# EAGLE design shinobi_BLE (EAGLE 8.5.1)
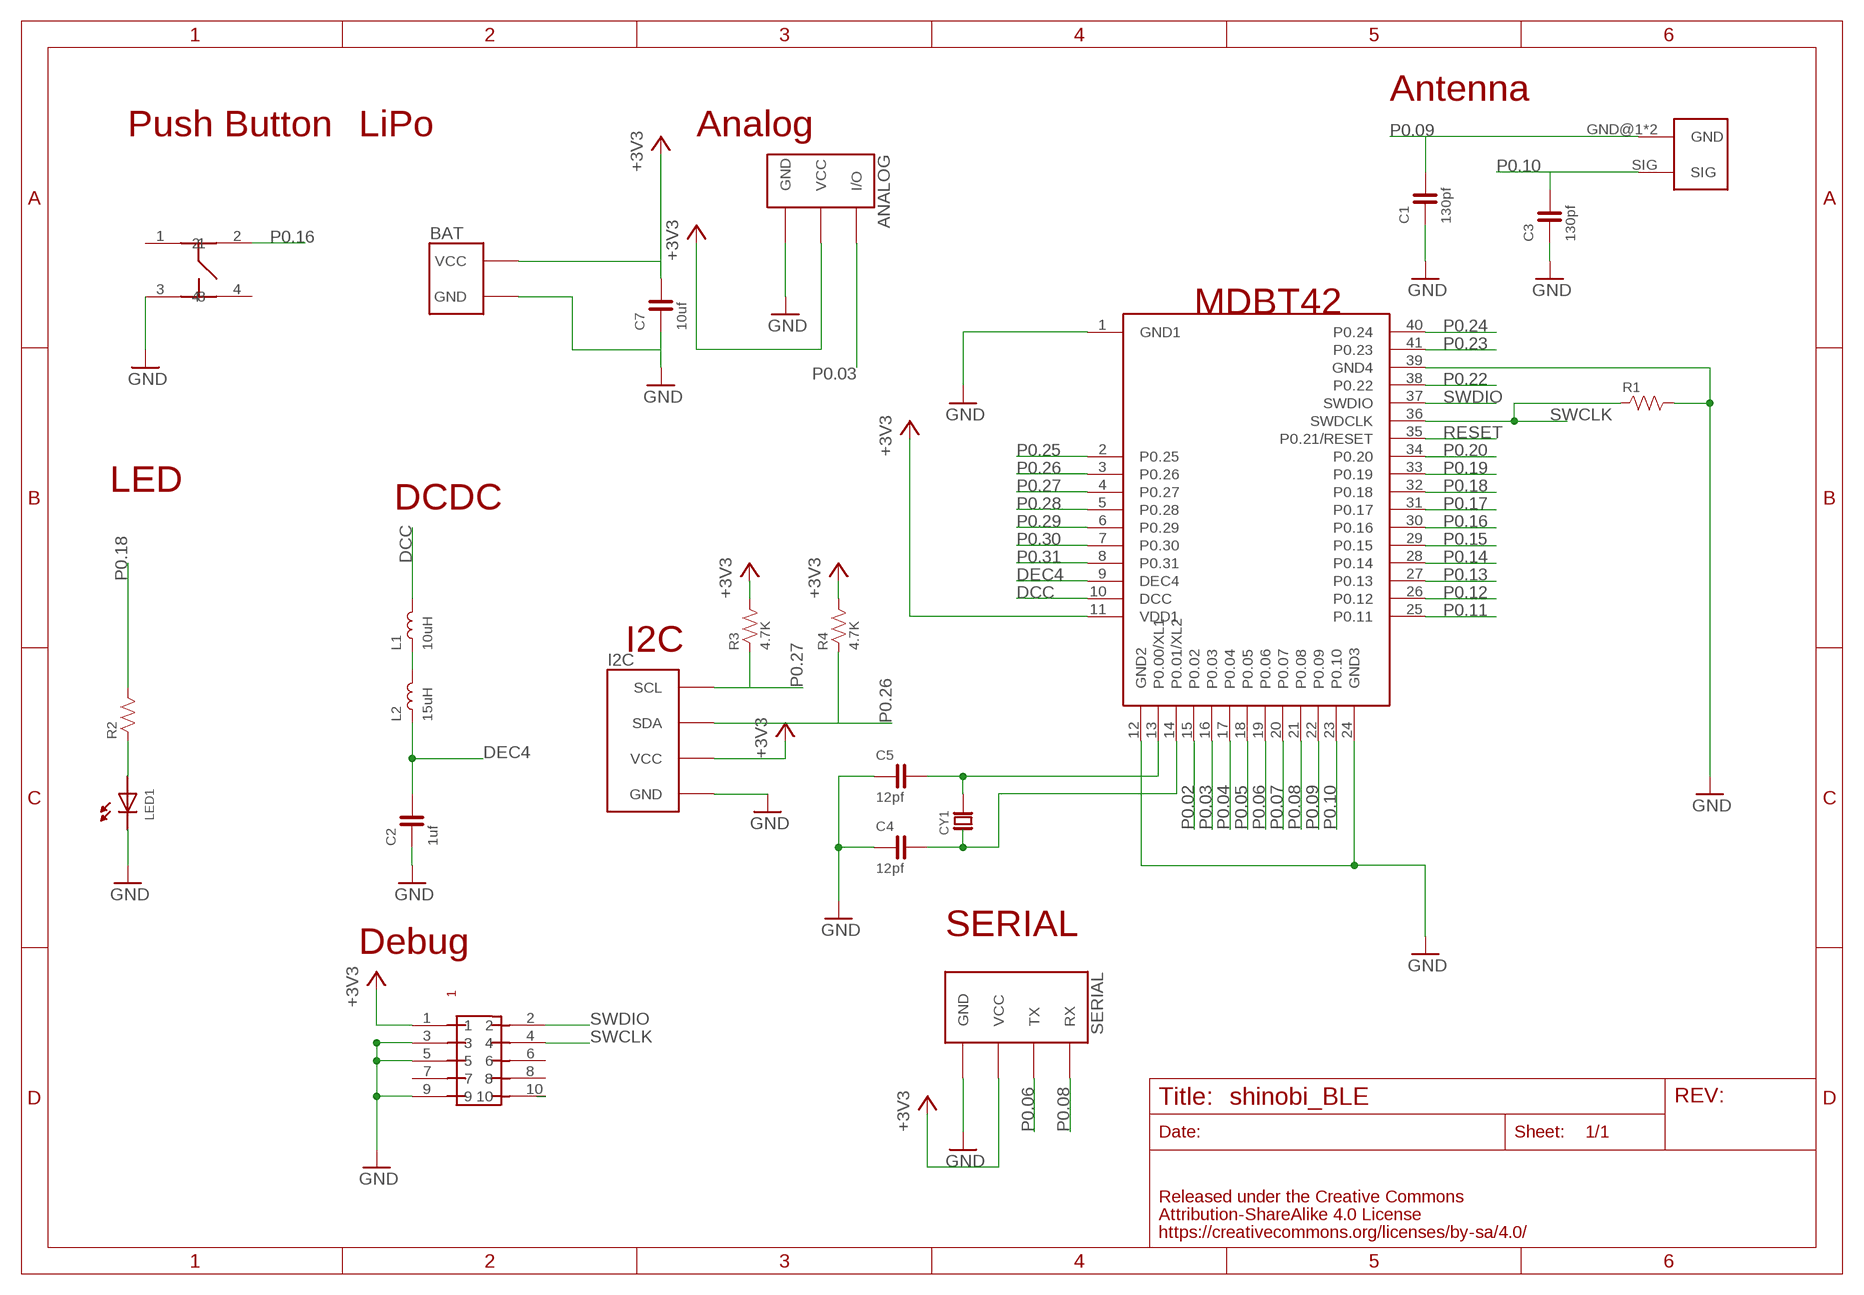
[diagram p0: schematic, sheet 1]

## Parts
ANALOG  FABO_BRICK_3PIN-S03B-PASK-2_LONG  [FABO_BRICK_3PIN_S03B-PASK-2_LONG]
BAT  FABO_BRICK_2PIN_SIDE  [FABO_BRICK_2PIN_S02B−PASK-2_SILK]
C1  130pf  CAPACITOR-0603  [0603]
C2  1uf  CAPACITOR-0603  [0603]
C3  130pf  CAPACITOR-0603  [0603]
C4  12pf  CAPACITOR-0603  [0603]
C5  12pf  CAPACITOR-0603  [0603]
C7  10uf  CAPACITOR-0603  [0603]
CY1  CRYSTAL-ABS07  [ABRACON-ABS07-32.768KHZ]
I2C  FABO_BRICK_I2C-S04B-PASK-2_LONG  [FABO_BRICK_I2C_S04B-PASK-2_LONG]
L1  10uH  INDUCTOR-0603  [0603]
L2  15uH  INDUCTOR-1812  [1812]
LED1  LED-0603  [0603]
R1  RESISTOR-0603  [0603]
R2  RESISTOR-0603  [0603]
R3  4.7K  RESISTOR-0603  [0603]
R4  4.7K  RESISTOR-0603  [0603]
SERIAL  FABO_BRICK_SERIAL-S04B-PASK-2_LONG  [FABO_BRICK_SERIAL_S04B-PASK-2_LONG]
U$2  RAYTAC-MDBT42  [RAYTAC-MDBT42]
U$4  PIN-HEADER-SMT(1.27MM)2X5  [PIN-HEADER-SMT(1.27MM)2X5]
U$5  SWICTH-4P(KMR2)  [SWITCH-4P(KMR2)]
UF1  HIROSE-U.FL  [HIROSE-UF.L]

## Nets
+3V3: ANALOG.VCC BAT.VCC C7.2 I2C.VCC R3.2 R4.2 SERIAL.VCC U$2.11(VDD1) U$4.1
DCC: L1.2 U$2.10(DCC)
DEC4: C2.2 L2.P$1 U$2.9(DEC4)
GND: ANALOG.GND BAT.GND C1.1 C2.1 C3.1 C4.1 C5.1 C7.1 I2C.GND LED1.CATHODE R1.2 SERIAL.GND U$2.1(GND1) U$2.12(GND2) U$2.24(GND3) U$2.39(GND4) U$4.3 U$4.5 U$4.9 U$5.3
N$1: LED1.ANODE R2.1
N$2: L1.1 L2.P$2
N$7: C5.2 CY1.P$2 U$2.13(P0.00/XL1)
N$8: C4.2 CY1.P$1 U$2.14(P0.01/XL2)
P0.02: U$2.15(P0.02)
P0.03: ANALOG.I/O U$2.16(P0.03)
P0.04: U$2.17(P0.04)
P0.05: U$2.18(P0.05)
P0.06: SERIAL.TX U$2.19(P0.06)
P0.07: U$2.20(P0.07)
P0.08: SERIAL.RX U$2.21(P0.08)
P0.09: C1.2 U$2.22(P0.09) UF1.GND@1(GND) UF1.GND@2(GND)
P0.10: C3.2 U$2.23(P0.10) UF1.SIG
P0.11: U$2.25(P0.11)
P0.12: U$2.26(P0.12)
P0.13: U$2.27(P0.13)
P0.14: U$2.28(P0.14)
P0.15: U$2.29(P0.15)
P0.16: U$2.30(P0.16) U$5.2
P0.17: U$2.31(P0.17)
P0.18: R2.2 U$2.32(P0.18)
P0.19: U$2.33(P0.19)
P0.20: U$2.34(P0.20)
P0.22: U$2.38(P0.22)
P0.23: U$2.41(P0.23)
P0.24: U$2.40(P0.24)
P0.25: U$2.2(P0.25)
P0.26: I2C.SDA R4.1 U$2.3(P0.26)
P0.27: I2C.SCL R3.1 U$2.4(P0.27)
P0.28: U$2.5(P0.28)
P0.29: U$2.6(P0.29)
P0.30: U$2.7(P0.30)
P0.31: U$2.8(P0.31)
RESET: U$2.35(P0.21/RESET)
RESET1: U$4.10
SWCLK: R1.1 U$2.36(SWDCLK) U$4.4
SWDIO: U$2.37(SWDIO) U$4.2
Unconnected: U$4.6 U$4.7 U$4.8 U$5.1 U$5.4

## Notes on the sheet
- Antenna
- Push Button | LiPo | Analog
- MDBT42
- LED
- DCDC
- I2C
- SERIAL
- Debug

## Library data of the parts
ANALOG = FaBo-Template:FABO_BRICK_3PIN: FaBo Brick 3pin
BAT = FaBo-Template:FABO_BRICK_2PIN
C1-C5 C7 = FaBo-Capacitor:CAPACITOR: CAPACITOR
CY1 = FaBo-Crystal:CRYSTAL
I2C = FaBo-Template:FABO_BRICK_I2C: FaBo Brick I2C
L1 L2 = FaBo-Inductor:INDUCTOR: RESISTOR
LED1 = FaBo-LED:LED
R1-R4 = FaBo-Resistors:RESISTOR: RESISTOR
SERIAL = FaBo-Template:FABO_BRICK_SERIAL: FaBo Brick Serial
U$2 = FaBo-BT:RAYTAC-MDBT42
U$4 = gclue:PIN-HEADER-SMT(1.27MM)2X5: PIN-HEADER-SMT (1.27MM) 2x5
U$5 = gclue-test:SWICTH-4P(KMR2)
UF1 = FaBo-Connetor:HIROSE-U.FL

## Board
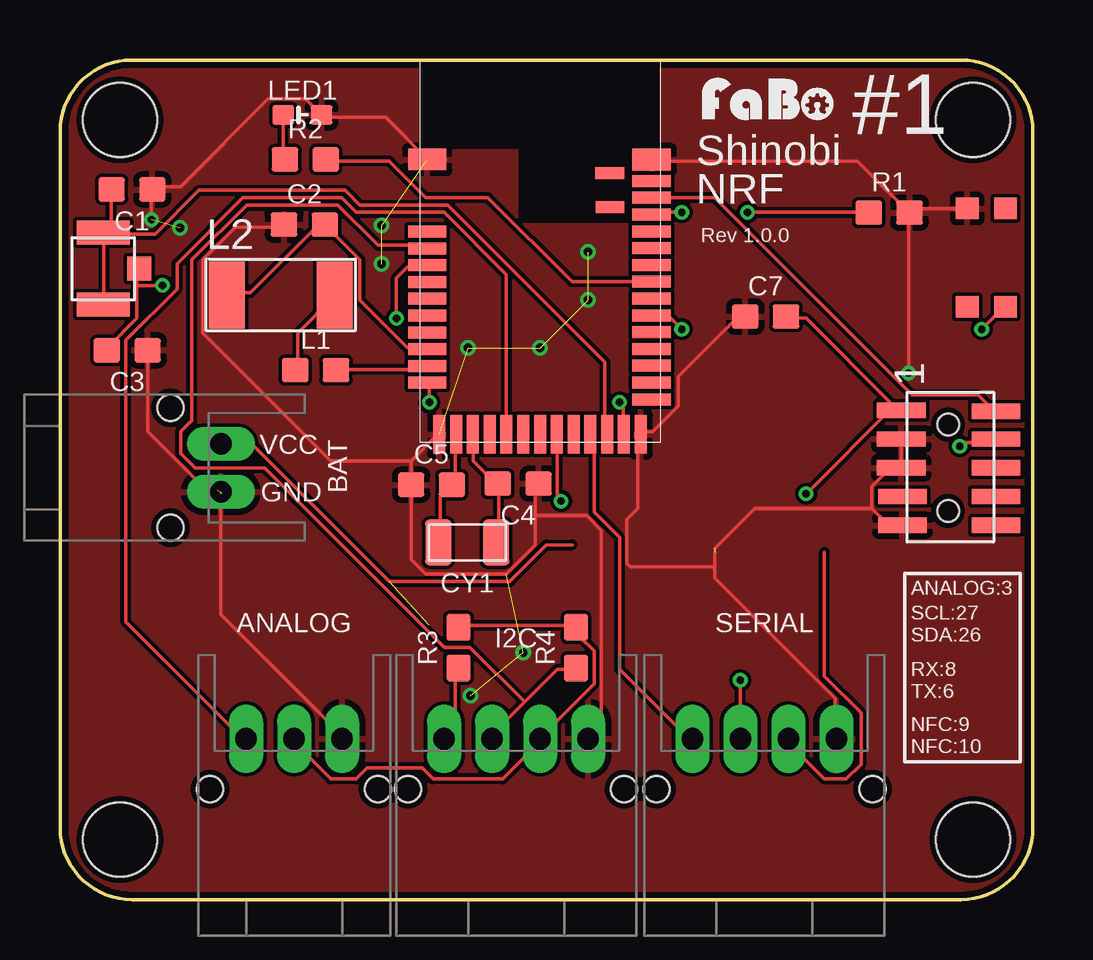
[diagram p1: board, top side]
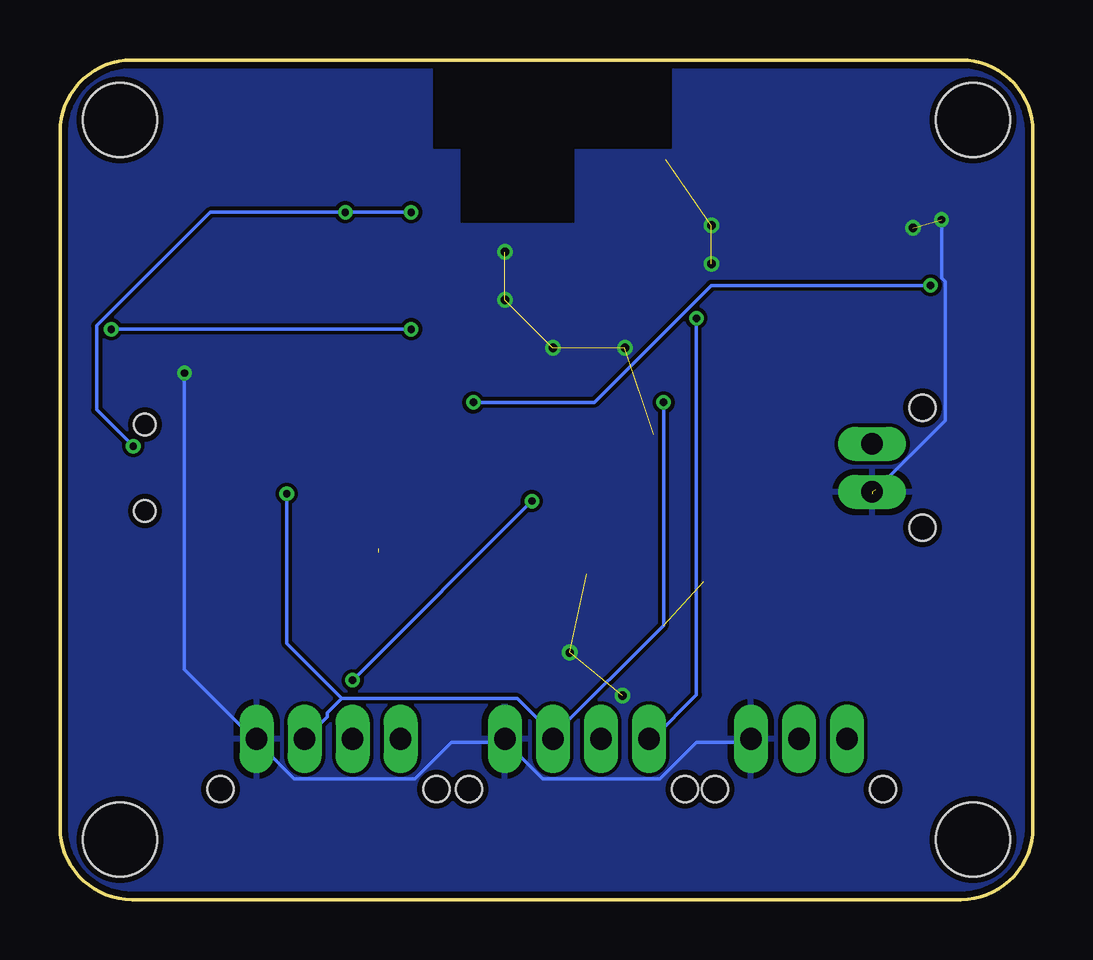
[diagram p2: board, bottom side, seen from below]

Size 40.54 x 35 mm. Coordinates in mm from the lower left corner, seen from the top.
Copper layers (1*16): Top 0.035mm / dielectric 1.5mm / Bottom 0.035mm
Design rules "SeeedStudio_2layer_DRU_no_angle_20140221": minimum track width 6mil, minimum drill 12mil, track to track 6mil, track to pad 6mil, pad to pad 6mil, via to via 6mil, smd to smd 0mil, copper to edge 10mil, drill to drill 10mil, minimum pad ring 10mil, minimum via ring 6mil, stop-mask expansion 2mil, vias tented up to drill 100mil, thermal gap 10mil

### Footprints (pad centres in the part's own frame; a part is rotated, then mirrored left to right if it is on the bottom)
FABO_BRICK_3PIN_S03B-PASK-2_LONG = drill 0.9 pad 1.422 long: GND -2,0; I/O 2,0; VCC 0,0 | hole 1.1: 3.5,2.1; -3.5,2.1
FABO_BRICK_2PIN_S02B−PASK-2_SILK = drill 0.9 pad 1.422 long: GND -1,-0.102; VCC 1,-0.102 | hole 1.1: 2.5,1.998; -2.5,1.998
0603 = smd 1.1 x 1: 1 -0.85,0; 2 0.85,0
ABRACON-ABS07-32.768KHZ = smd 1.1 x 1.9: P$1 -1.2,0; P$2 1.2,0
FABO_BRICK_I2C_S04B-PASK-2_LONG = drill 0.9 pad 1.422 long: GND -3,0; SCL 3,0; SDA 1,0; VCC -1,0 | hole 1.1: 4.5,2.1; -4.5,2.1
1812 = smd 1.5 x 2.8: P$1 -2.25,0; P$2 2.25,0
0603' = smd 0.9 x 0.8: ANODE -0.8,0; CATHODE 0.8,0
FABO_BRICK_SERIAL_S04B-PASK-2_LONG = drill 0.9 pad 1.422 long: GND -3,0; RX 3,0; TX 1,0; VCC -1,0 | hole 1.1: 4.5,2.1; -4.5,2.1
FABO-SHINOBI = hole 3.1: 2.5,32.5; 38.04,32.5; 38.04,2.5; 2.5,2.5
RAYTAC-MDBT42 = smd 1.6 x 0.9: 1 -4.7,3.8; 39 4.65,3.79 | smd 1.6 x 0.5: 2 -4.7,0.79; 3 -4.7,0.09; 4 -4.7,-0.61; 5 -4.7,-1.31; 6 -4.7,-2.01; 7 -4.7,-2.71; 8 -4.7,-3.41; 9 -4.7,-4.11; 10 -4.7,-4.81; 11 -4.7,-5.51; 25 4.65,-6.2; 26 4.65,-5.5; 27 4.65,-4.8; 28 4.65,-4.1; 29 4.65,-3.4; 30 4.65,-2.7; 31 4.65,-2; 32 4.65,-1.3; 33 4.65,-0.6; 34 4.65,0.1; 35 4.65,0.8; 36 4.65,1.5; 37 4.65,2.2; 38 4.65,2.9 | smd 0.5 x 1.6: 12 -4.2,-7.66; 13 -3.5,-7.66; 14 -2.8,-7.66; 15 -2.1,-7.66; 16 -1.4,-7.66; 17 -0.7,-7.66; 18 0,-7.66; 19 0.7,-7.66; 20 1.4,-7.66; 21 2.1,-7.66; 22 2.8,-7.66; 23 3.48,-7.66; 24 4.2,-7.66 | smd 1.2 x 0.5: 40 2.91,3.23; 41 2.92,1.81
PIN-HEADER-SMT(1.27MM)2X5 = smd 0.635 x 2.032: 1 -2.4,-1.95; 2 -2.35,2; 3 -1.2,-1.95; 4 -1.2,2; 5 0,-1.95; 6 0,2; 7 1.2,-1.9; 8 1.2,2; 9 2.4,-1.9; 10 2.4,2 | hole 0.9: 1.8,0; -1.8,0
SWITCH-4P(KMR2) = smd 0.9 x 0.95: 1 -1,0; 2 3.1,0; 3 -1,-1.6; 4 3.1,-1.6
HIROSE-UF.L = smd 1 x 2.2: GND@1 -1.5,0; GND@2 1.5,0 | smd 1 x 1: SIG 0,-1.5

### Placement (x,y rotation side)
ANALOG  9.75,6.7 180 top
BAT  6.6,18 90 top
C1  3,29.6 180 top
C2  10.18,28.14 0 top
C3  2.8,22.9 180 top
C4  19.09,17.34 180 top
C5  15.48,17.29 0 top
C7  29.4,24.3 0 top
CY1  16.97,14.89 180 top
I2C  19,6.7 180 top
L1  10.65,22.07 0 top
L2  9.2,25.2 0 top
LED1  [0603']  10.1,32.71 0 top
R1  34.55,28.63 0 top
R2  10.22,30.85 0 top
R3  16.6,10.5 90 top
R4  21.5,10.5 90 top
SERIAL  29.35,6.7 180 top
U$1  [FABO-SHINOBI]  0,0 0 top
U$2  20,27.05 0 top
U$3  [LOGO_FABO_S]  29.55,32.35 0 top
U$4  37,18 270 top
U$5  39.4,27.81 270 top
UF1  1.8,26.3 90 top

### Tracks (layer width: path | path; a pad name or v marks a point on that pad's centre or on a via)
+3V3  (via drill 0.3)  (1 unrouted)
  Top 0.152: 34.75,20.57 34.9,20.42 U$4.1 34.75,20.57 | 34.75,20.57 31.09,24.23 30.33,24.23 C7.2 | R3.2 16.61,11.43 21.49,11.43 R4.2 21.64,11.28 21.64,10.97 22.25,10.36 22.25,8.99 19.96,6.71 I2C.VCC 19.96,6.55 18.44,5.03 15.54,5.03 15.09,5.49 12.8,5.49 12.34,5.03 11.28,5.03 9.75,6.55 ANALOG.VCC | v15.39,20.73 15.39,21.49 U$2.11 | 31.85,14.48 31.85,9.3 33.38,7.77 33.38,5.64 32.77,5.03 31.85,5.03 30.33,6.55 SERIAL.VCC | v31.09,16.92 34.75,20.57 | 21.34,14.78 20.27,14.78 18.75,13.26 13.72,13.26 8.08,18.9 6.71,18.9 BAT.VCC
  Bottom 0.152: v15.39,20.73 15.39,11.43 19.96,6.86 | 19.96,6.86 20.12,6.71 I2C.VCC 19.96,6.86 | 28.8,8.38 29.41,7.77 29.41,7.62 30.33,6.71 SERIAL.VCC | 28.8,8.38 21.49,8.38 19.96,6.86 | v31.09,16.92 31.09,10.67 28.8,8.38
DCC
  Top 0.152: L1.2 11.58,22.1 15.24,22.1 U$2.10
DEC4
  Top 0.152: L2.P$1 7.01,25.3 7.92,25.3 10.67,28.04 10.97,28.04 C2.2 11.12,28.04 12.5,26.67 12.5,24.99 14.48,23.01 15.24,23.01 U$2.9
GND  (via drill 0.3, 0.35)  (13 unrouted)
  Top 0.152: U$5.3 35.66,28.8 35.51,28.65 R1.2 | U$2.39 24.69,30.79 33.22,30.79 35.36,28.65 R1.2 | C7.1 28.5,24.23 28.19,24.23 25.76,21.79 25.76,20.57 24.69,19.51 24.23,19.51 U$2.24 24.08,19.36 24.08,16.31 23.62,15.85 23.62,14.02 23.77,13.87 27.28,13.87 | U$4.3 35.05,19.05 35.05,18.14 U$4.5 34.9,17.98 34.59,17.98 33.83,17.22 33.83,16.31 | 33.83,16.31 34.44,15.7 35.05,15.7 U$4.9 | 27.28,14.48 27.28,13.87 | 27.28,13.87 27.28,13.41 32.31,8.38 32.31,6.71 SERIAL.GND | 33.83,16.31 28.96,16.31 27.28,14.63 | v35.36,21.95 35.36,28.5 R1.2 | 14.63,18.29 14.63,17.37 C5.1 14.63,17.22 14.63,14.17 15.24,13.56 18.59,13.56 19.81,14.78 19.81,16 | 14.63,18.29 15.7,19.36 U$2.12 | 14.63,18.29 11.28,18.29 5.94,23.62 5.94,26.67 7.32,28.04 9.3,28.04 C2.1 | 19.81,16 19.81,17.22 C4.1 | U$2.1 15.24,30.94 13.56,32.61 10.97,32.61 LED1.CATHODE 10.82,32.77 10.21,33.38 8.69,33.38 5.03,29.72 3.96,29.72 C1.1 3.81,29.57 v3.81,28.35 | 6.55,17.07 6.1,17.07 3.66,19.51 3.66,22.86 C3.1 | 6.71,16.92 6.71,11.89 11.89,6.71 ANALOG.GND | 19.81,16 21.95,16 22.55,15.39 22.55,7.16 22.1,6.71 I2C.GND
  Bottom 0.152: v35.36,21.95 35.36,9.6 32.46,6.71 SERIAL.GND 32.31,6.55 30.79,5.03 25.76,5.03 24.23,6.55 22.1,6.55 I2C.GND 21.95,6.55 20.42,5.03 15.54,5.03 14.02,6.55 11.89,6.55 ANALOG.GND | v3.81,28.35 3.81,25.91 3.66,25.76 3.66,19.96 6.55,17.07
  other vias: 5,28 20,23 17,23 22,25 22,27 13.4,26.5 13.4,28.1 19.3,10.3 17.1,8.5
  pour Bottom: 0,0 41,0 41,35 0,35
  pour Top: 0,0 41,0 41,35 0,35
N$1
  Top 0.152: LED1.ANODE 9.3,32.61 9.3,30.94 R2.1
N$2
  Top 0.152: L1.1 9.91,22.1 9.91,23.62 11.43,25.15 L2.P$2
N$7
  Top 0.152: U$2.13 16.46,19.36 16.46,17.37 C5.2 16.31,17.22 15.85,16.76 15.85,14.94 CY1.P$2
N$8
  Top 0.152: CY1.P$1 18.29,14.94 18.29,17.22 C4.2 18.14,17.37 17.22,18.29 17.22,19.36 U$2.14
P0.03
  Top 0.152: U$2.16 18.59,19.51 18.59,26.06 16,28.65 12.34,28.65 11.73,29.26 7.62,29.26 4.88,26.52 4.88,25.45 2.74,23.32 2.74,11.58 7.62,6.71 ANALOG.I/O
P0.06  (via drill 0.3)
  Top 0.152: v20.88,16.61 20.73,16.76 20.73,19.36 U$2.19 | v28.35,9.14 SERIAL.TX
  Bottom 0.152: v28.35,9.14 v20.88,16.61
P0.08
  Top 0.152: U$2.21 22.25,19.36 22.25,16.15 23.32,15.09 23.32,9.6 26.21,6.71 SERIAL.RX
P0.09
  Top 0.152: C1.2 2.13,29.57 2.13,28.19 1.83,27.89 UF1.GND@2 1.83,27.74 | 1.83,27.74 3.96,27.74 5.79,29.57 11.89,29.57 12.5,28.96 16.15,28.96 22.71,22.4 22.71,19.51 U$2.22 | 1.83,27.74 1.83,24.84 UF1.GND@1
P0.10  (via drill 0.3)
  Top 0.152: 3.2,25.6 3.2,24.23 1.98,23.01 C3.2 | 3.2,25.6 3.2,26.21 UF1.SIG | v23.32,20.73 23.47,20.57 23.47,19.51 U$2.23 | 3.2,25.6 v4.27,25.6
  Bottom 0.152: v23.32,20.73 18.29,20.73 13.41,25.6 v4.27,25.6
P0.16  (via drill 0.3)
  Top 0.152: v38.41,23.77 39.32,24.69 U$5.2 | v25.91,23.77 25.45,24.23 24.69,24.23 U$2.30
  Bottom 0.152: v25.91,23.77 v38.41,23.77
P0.18
  Top 0.152: R2.2 11.12,30.79 13.72,30.79 15.24,29.26 17.83,29.26 21.34,25.76 24.54,25.76 U$2.32
P0.26
  Top 0.152: 19.36,8.23 18.14,7.01 18.14,6.71 I2C.SDA | 19.36,8.23 20.73,9.6 21.49,9.6 R4.1 | 19.36,8.23 17.07,10.52 16,10.52 8.53,17.98 5.64,17.98 5.03,18.59 5.03,19.51 5.49,19.96 5.49,26.67 7.77,28.96 11.58,28.96 13.26,27.28 15.24,27.28 U$2.3
P0.27  (via drill 0.3)
  Top 0.152: R3.1 16.46,9.6 16.46,7.16 I2C.SCL | v14.02,24.23 14.02,25.91 14.48,26.36 15.24,26.36 U$2.4
  Bottom 0.152: v14.02,24.23 14.02,8.53 15.85,6.71 I2C.SCL
SWCLK  (via drill 0.3)
  Top 0.152: v28.65,28.65 33.68,28.65 R1.1 | v25.91,28.65 24.69,28.65 U$2.36 | v37.49,18.9 37.64,19.05 38.86,19.05 U$4.4
  Bottom 0.152: v25.91,28.65 v28.65,28.65 34.29,28.65 39.01,23.93 39.01,20.42 v37.49,18.9
SWDIO
  Top 0.152: U$2.37 24.69,29.26 27.28,29.26 35.51,21.03 38.25,21.03 38.86,20.42 U$4.2

### Text on the board
tPlace: #1 | Shinobi | NRF | Rev 1.0.0 | ANALOG:3 | SCL:27 / SDA:26 | RX:8 / TX:6 | NFC:9 / NFC:10